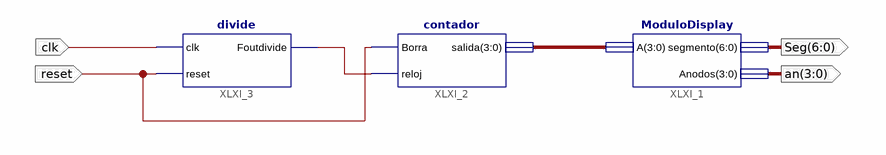
[diagram p0: schematic sheet 1]
// Xilinx ISE schematic SuperiorConatadorDisplay.sch (spartan6) as structural Verilog: 3 symbols, 4 ports
module SuperiorConatadorDisplay (
  input  clk,
  input  reset,
  output [6:0] Seg,
  output [3:0] an
);

  wire XLXN_6;
  wire [3:0] XLXN_5;

  ModuloDisplay XLXI_1 (.A(XLXN_5), .segmento(Seg), .Anodos(an));
  contador XLXI_2 (.Borra(reset), .reloj(XLXN_6), .salida(XLXN_5));
  divide XLXI_3 (.clk(clk), .reset(reset), .Foutdivide(XLXN_6));
endmodule
